# EAGLE design mainboard (EAGLE 6.1)

## Sheet 1 of 8
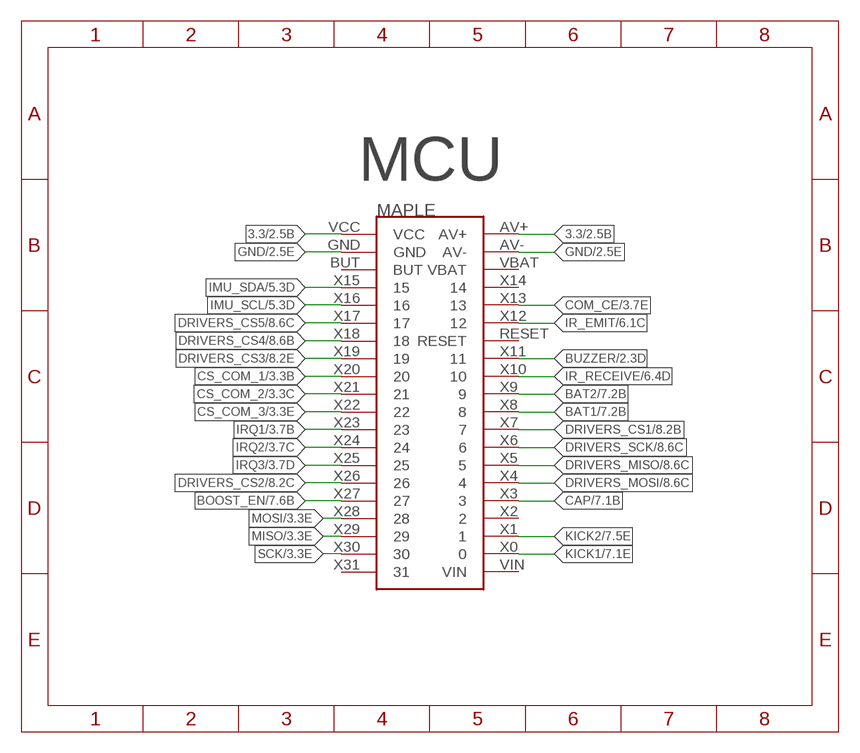
[diagram p0: schematic, sheet 1]

### Parts
MAPLE  MAPLE_MINI  [CONNEC_2X20]

### Nets
3.3: MAPLE.AV+ MAPLE.VCC ; also sheet 2,3,4,5,6,7,8
BAT1: MAPLE.X8 ; also sheet 7
BAT2: MAPLE.X9 ; also sheet 7
BOOST_EN: MAPLE.X27 ; also sheet 7
BUZZER: MAPLE.X11 ; also sheet 2
CAP: MAPLE.X3 ; also sheet 7
COM_CE: MAPLE.X13 ; also sheet 3
CS_COM_1: MAPLE.X20 ; also sheet 3
CS_COM_2: MAPLE.X21 ; also sheet 3
CS_COM_3: MAPLE.X22 ; also sheet 3
DRIVERS_CS1: MAPLE.X7 ; also sheet 8
DRIVERS_CS2: MAPLE.X26 ; also sheet 8
DRIVERS_CS3: MAPLE.X19 ; also sheet 8
DRIVERS_CS4: MAPLE.X18 ; also sheet 8
DRIVERS_CS5: MAPLE.X17 ; also sheet 8
DRIVERS_MISO: MAPLE.X5 ; also sheet 8
DRIVERS_MOSI: MAPLE.X4 ; also sheet 8
DRIVERS_SCK: MAPLE.X6 ; also sheet 8
GND [alim_big]: MAPLE.AV- MAPLE.GND ; also sheet 2,3,4,5,6,7,8
IMU_SCL: MAPLE.X16 ; also sheet 5
IMU_SDA: MAPLE.X15 ; also sheet 5
IR_EMIT: MAPLE.X12 ; also sheet 6
IR_RECEIVE: MAPLE.X10 ; also sheet 6
IRQ1: MAPLE.X23 ; also sheet 3
IRQ2: MAPLE.X24 ; also sheet 3
IRQ3: MAPLE.X25 ; also sheet 3
KICK1: MAPLE.X0 ; also sheet 7
KICK2: MAPLE.X1 ; also sheet 7
MISO: MAPLE.X29 ; also sheet 3
MOSI: MAPLE.X28 ; also sheet 3
SCK: MAPLE.X30 ; also sheet 3
Unconnected: MAPLE.BUT MAPLE.RESET MAPLE.VBAT MAPLE.VIN MAPLE.X2 MAPLE.X14 MAPLE.X31

### Notes on the sheet
- MCU

## Sheet 2 of 8
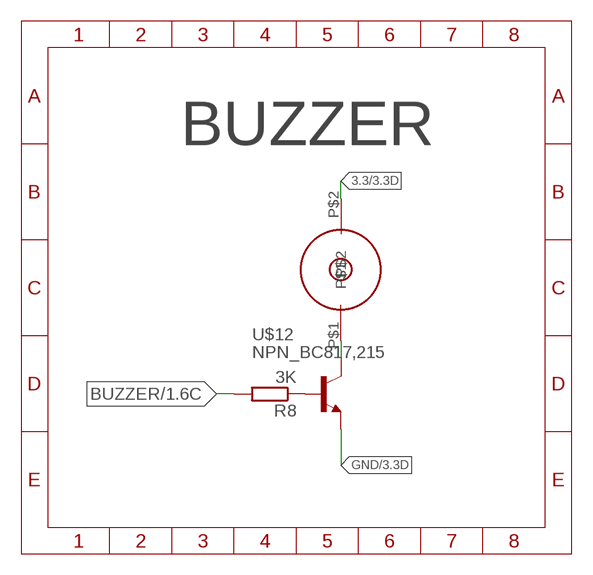
[diagram p1: schematic, sheet 2]

### Parts
R8  3K  R-EU_R0805  [R0805]
U$12  NPN_BC817,215  [SOT-23]
U$13  BUZZER66  [BUZZER66]

### Nets
3.3: U$13.P$2 ; also sheet 1,3,4,5,6,7,8
BUZZER: R8.2 ; also sheet 1
GND [alim_big]: U$12.2(E) ; also sheet 1,3,4,5,6,7,8
N$3: R8.1 U$12.1(B)
N$5: U$12.3(C) U$13.P$1

### Notes on the sheet
- BUZZER

## Sheet 3 of 8
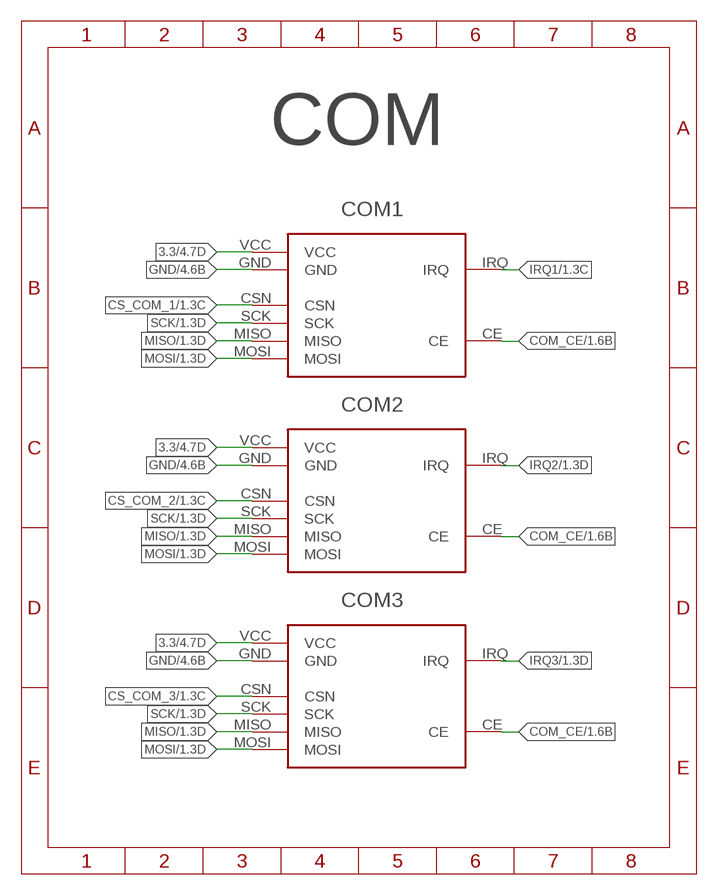
[diagram p2: schematic, sheet 3]

### Parts
COM1  NRF24L01  [NRF24L01]
COM2  NRF24L01  [NRF24L01]
COM3  NRF24L01  [NRF24L01]

### Nets
3.3: COM1.VCC COM2.VCC COM3.VCC ; also sheet 1,2,4,5,6,7,8
COM_CE: COM1.CE COM2.CE COM3.CE ; also sheet 1
CS_COM_1: COM1.CSN ; also sheet 1
CS_COM_2: COM2.CSN ; also sheet 1
CS_COM_3: COM3.CSN ; also sheet 1
GND [alim_big]: COM1.GND COM2.GND COM3.GND ; also sheet 1,2,4,5,6,7,8
IRQ1: COM1.IRQ ; also sheet 1
IRQ2: COM2.IRQ ; also sheet 1
IRQ3: COM3.IRQ ; also sheet 1
MISO: COM1.MISO COM2.MISO COM3.MISO ; also sheet 1
MOSI: COM1.MOSI COM2.MOSI COM3.MOSI ; also sheet 1
SCK: COM1.SCK COM2.SCK COM3.SCK ; also sheet 1

### Notes on the sheet
- COM

## Sheet 4 of 8
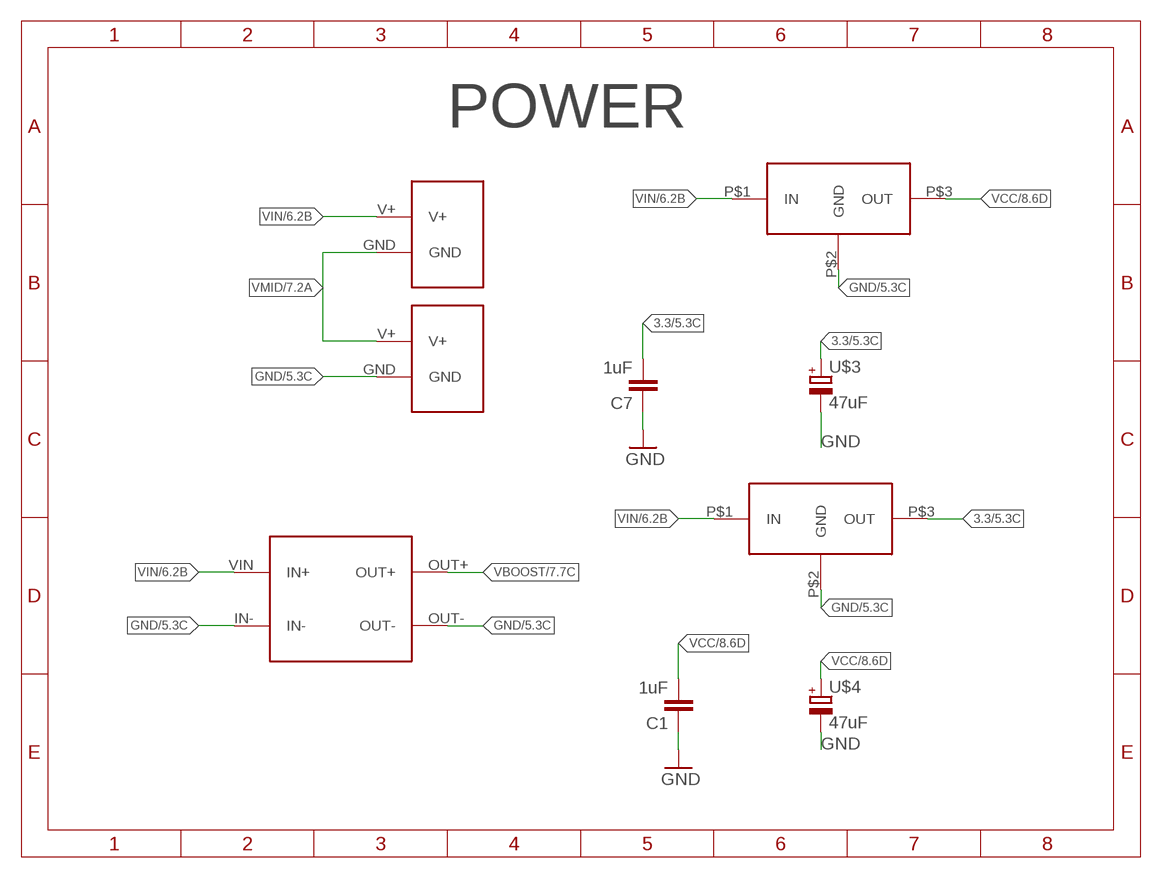
[diagram p3: schematic, sheet 4]

### Parts
C1  1uF  CAP0805  [0805@1]
C7  1uF  CAP0805  [0805@1]
REG3.3V  REG_5V  [TRACOPOWER]
REG5V  REG_5V  [TRACOPOWER]
U$3  47uF  CPOL_EUPANASONIC_D  [PANASONIC_D]
U$4  47uF  CPOL_EUPANASONIC_D  [PANASONIC_D]
U$5  BOOSTER  [BOOSTER_390V]
XT1  CONNEC_ALIM  [XT60]
XT60  CONNEC_ALIM  [XT60]

### Nets
3.3: C7.2 REG3.3V.P$3(OUT) U$3.+ ; also sheet 1,2,3,5,6,7,8
GND [alim_big]: C1.1 C7.1 REG3.3V.P$2(GND) REG5V.P$2(GND) U$3.- U$4.- U$5.IN- U$5.OUT- XT60.GND ; also sheet 1,2,3,5,6,7,8
VBOOST: U$5.OUT+ ; also sheet 7
VCC: C1.2 REG5V.P$3(OUT) U$4.+ ; also sheet 8
VIN [alim_big]: REG3.3V.P$1(IN) REG5V.P$1(IN) U$5.VIN(IN+) XT1.V+ ; also sheet 6,7,8
VMID [alim_big]: XT1.GND XT60.V+ ; also sheet 7,8

### Notes on the sheet
- POWER

## Sheet 5 of 8
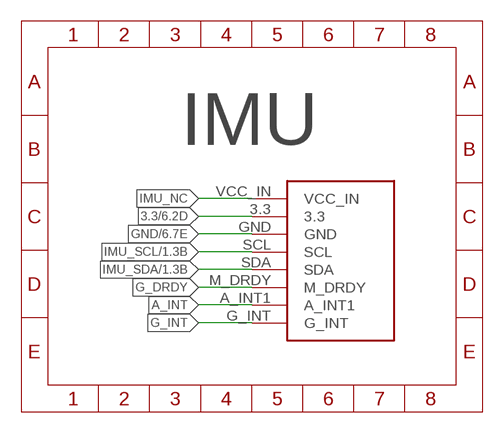
[diagram p4: schematic, sheet 5]

### Parts
U$2  GY-85  [GY-85]

### Nets
3.3: U$2.3.3 ; also sheet 1,2,3,4,6,7,8
A_INT: U$2.A_INT1
G_DRDY: U$2.M_DRDY
G_INT: U$2.G_INT
GND [alim_big]: U$2.GND ; also sheet 1,2,3,4,6,7,8
IMU_NC: U$2.VCC_IN
IMU_SCL: U$2.SCL ; also sheet 1
IMU_SDA: U$2.SDA ; also sheet 1

### Notes on the sheet
- IMU

## Sheet 6 of 8
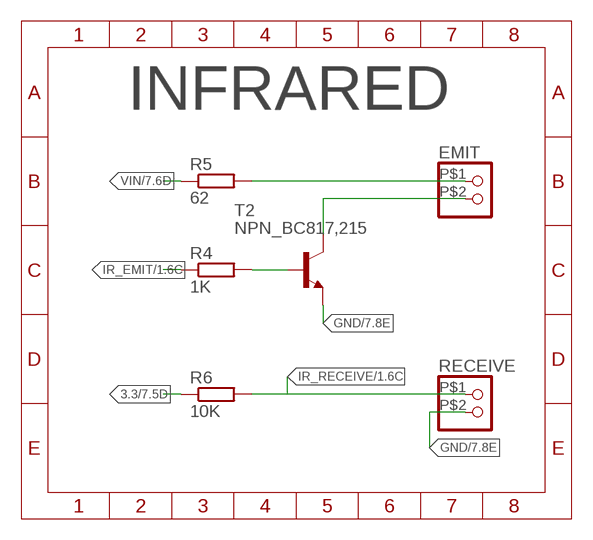
[diagram p5: schematic, sheet 6]

### Parts
EMIT  CONNEC_1X02JST-ZH  [JST_ZH_2P]
R4  1K  RESISTANCE-R0805  [R0805]
R5  62  RESISTANCE-R0805  [R0805]
R6  10K  RESISTANCE-R0805  [R0805]
RECEIVE  CONNEC_1X02JST-ZH  [JST_ZH_2P]
T2  NPN_BC817,215  [SOT-23]

### Nets
3.3: R6.1 ; also sheet 1,2,3,4,5,7,8
GND [alim_big]: RECEIVE.P$2 T2.2(E) ; also sheet 1,2,3,4,5,7,8
IR_EMIT: R4.1 ; also sheet 1
IR_RECEIVE: R6.2 RECEIVE.P$1 ; also sheet 1
N$6: EMIT.P$1 R5.2
N$7: EMIT.P$2 T2.3(C)
N$11: R4.2 T2.1(B)
VIN [alim_big]: R5.1 ; also sheet 4,7,8

### Notes on the sheet
- INFRARED

## Sheet 7 of 8
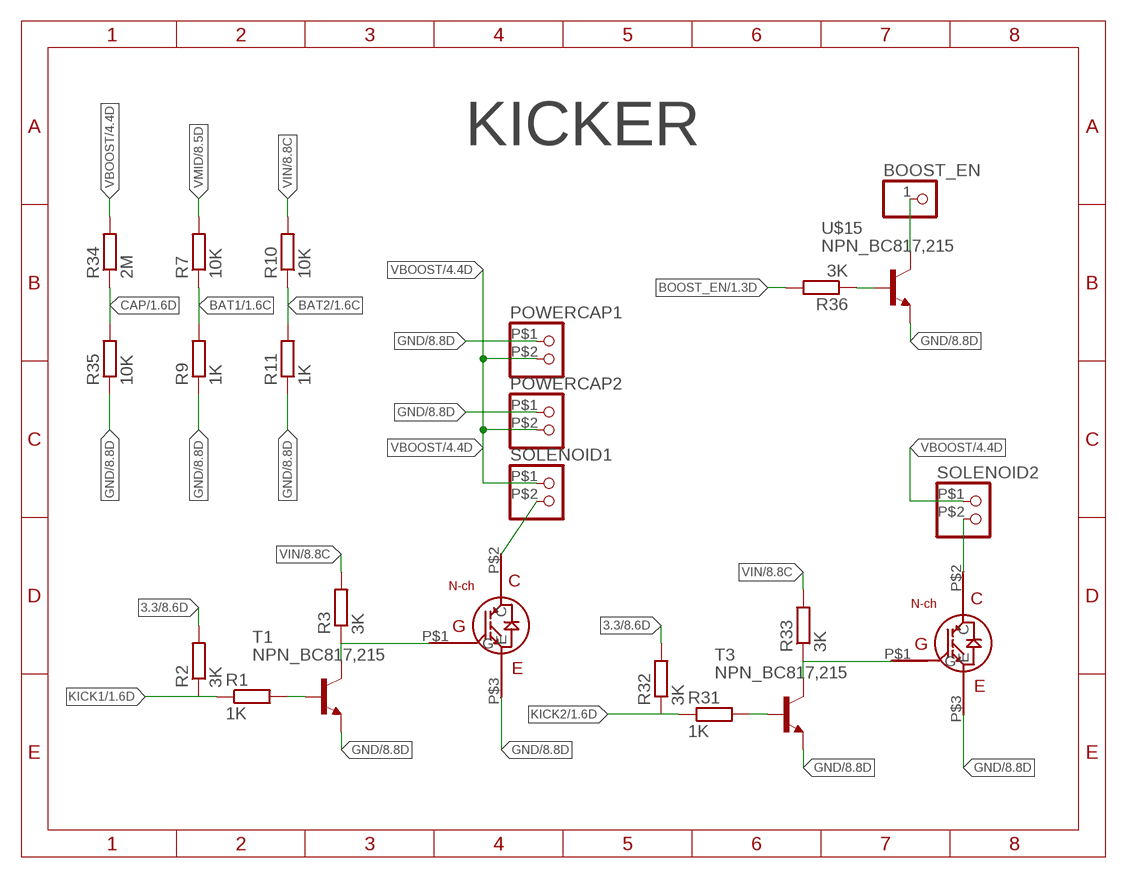
[diagram p6: schematic, sheet 7]

### Parts
BOOST_EN  CONNEC_1X01  [CONNEC_1X01]
POWERCAP1  CONNEC_1X02BIG  [CONNEC_1X02_BIG]
POWERCAP2  CONNEC_1X02BIG  [CONNEC_1X02_BIG]
R1  1K  RESISTANCE-R0805  [R0805]
R2  3K  RESISTANCE-R0805  [R0805]
R3  3K  RESISTANCE-R0805  [R0805]
R7  10K  RESISTANCE-R0805  [R0805]
R9  1K  RESISTANCE-R0805  [R0805]
R10  10K  RESISTANCE-R0805  [R0805]
R11  1K  RESISTANCE-R0805  [R0805]
R31  1K  RESISTANCE-R0805  [R0805]
R32  3K  RESISTANCE-R0805  [R0805]
R33  3K  RESISTANCE-R0805  [R0805]
R34  2M  RESISTANCE-R0805  [R0805]
R35  10K  RESISTANCE-R0805  [R0805]
R36  3K  RESISTANCE-R0805  [R0805]
SOLENOID1  CONNEC_1X02BIG  [CONNEC_1X02_BIG]
SOLENOID2  CONNEC_1X02BIG  [CONNEC_1X02_BIG]
T1  NPN_BC817,215  [SOT-23]
T3  NPN_BC817,215  [SOT-23]
U$1  TO-247A  [TO-247]
U$11  TO-247A  [TO-247]
U$15  NPN_BC817,215  [SOT-23]

### Nets
3.3: R2.2 R32.2 ; also sheet 1,2,3,4,5,6,8
BAT1: R7.1 R9.2 ; also sheet 1
BAT2: R10.1 R11.2 ; also sheet 1
BOOST_EN: R36.2 ; also sheet 1
CAP: R34.1 R35.2 ; also sheet 1
GND [alim_big]: POWERCAP1.P$1 POWERCAP2.P$1 R9.1 R11.1 R35.1 T1.2(E) T3.2(E) U$1.P$3(E) U$11.P$3(E) U$15.2(E) ; also sheet 1,2,3,4,5,6,8
KICK1: R1.1 R2.1 ; also sheet 1
KICK2: R31.1 R32.1 ; also sheet 1
N$1: R1.2 T1.1(B)
N$2 [alim_big]: SOLENOID1.P$2 U$1.P$2(C)
N$4: R3.1 T1.3(C) U$1.P$1(G)
N$17: R31.2 T3.1(B)
N$35: R33.1 T3.3(C) U$11.P$1(G)
N$36 [alim_big]: SOLENOID2.P$2 U$11.P$2(C)
N$37: BOOST_EN.1 U$15.3(C)
N$38: R36.1 U$15.1(B)
VBOOST: POWERCAP1.P$2 POWERCAP2.P$2 R34.2 SOLENOID1.P$1 SOLENOID2.P$1 ; also sheet 4
VIN [alim_big]: R3.2 R10.2 R33.2 ; also sheet 4,6,8
VMID [alim_big]: R7.2 ; also sheet 4,8

### Notes on the sheet
- KICKER

## Sheet 8 of 8
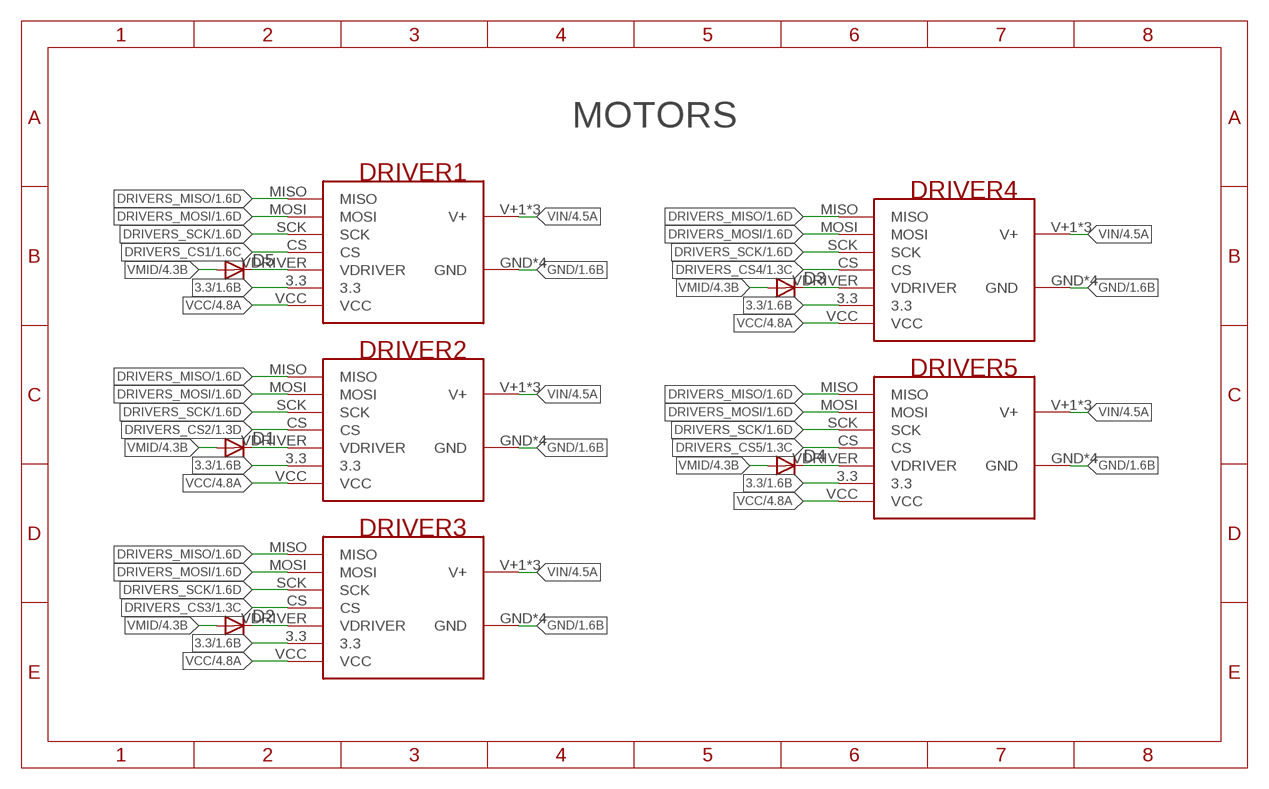
[diagram p7: schematic, sheet 8]

### Parts
D1  DIODESOD  [SOD-323]
D2  DIODESOD  [SOD-323]
D3  DIODESOD  [SOD-323]
D4  DIODESOD  [SOD-323]
D5  DIODESOD  [SOD-323]
DRIVER1  RHOBAN_BL_DRIVER  [RHOBAN_BL_DRIVER]
DRIVER2  RHOBAN_BL_DRIVER  [RHOBAN_BL_DRIVER]
DRIVER3  RHOBAN_BL_DRIVER  [RHOBAN_BL_DRIVER]
DRIVER4  RHOBAN_BL_DRIVER  [RHOBAN_BL_DRIVER]
DRIVER5  RHOBAN_BL_DRIVER  [RHOBAN_BL_DRIVER]

### Nets
3.3: DRIVER1.3.3 DRIVER2.3.3 DRIVER3.3.3 DRIVER4.3.3 DRIVER5.3.3 ; also sheet 1,2,3,4,5,6,7
DRIVERS_CS1: DRIVER1.CS ; also sheet 1
DRIVERS_CS2: DRIVER2.CS ; also sheet 1
DRIVERS_CS3: DRIVER3.CS ; also sheet 1
DRIVERS_CS4: DRIVER4.CS ; also sheet 1
DRIVERS_CS5: DRIVER5.CS ; also sheet 1
DRIVERS_MISO: DRIVER1.MISO DRIVER2.MISO DRIVER3.MISO DRIVER4.MISO DRIVER5.MISO ; also sheet 1
DRIVERS_MOSI: DRIVER1.MOSI DRIVER2.MOSI DRIVER3.MOSI DRIVER4.MOSI DRIVER5.MOSI ; also sheet 1
DRIVERS_SCK: DRIVER1.SCK DRIVER2.SCK DRIVER3.SCK DRIVER4.SCK DRIVER5.SCK ; also sheet 1
GND [alim_big]: DRIVER1.GND DRIVER1.GND2(GND) DRIVER1.GND3(GND) DRIVER1.GND4(GND) DRIVER2.GND DRIVER2.GND2(GND) DRIVER2.GND3(GND) DRIVER2.GND4(GND) DRIVER3.GND DRIVER3.GND2(GND) DRIVER3.GND3(GND) DRIVER3.GND4(GND) DRIVER4.GND DRIVER4.GND2(GND) DRIVER4.GND3(GND) DRIVER4.GND4(GND) DRIVER5.GND DRIVER5.GND2(GND) DRIVER5.GND3(GND) DRIVER5.GND4(GND) ; also sheet 1,2,3,4,5,6,7
N$8: D5.1(C) DRIVER1.VDRIVER
N$9: D3.1(C) DRIVER4.VDRIVER
N$10: D4.1(C) DRIVER5.VDRIVER
N$12: D2.1(C) DRIVER3.VDRIVER
N$13: D1.1(C) DRIVER2.VDRIVER
VCC: DRIVER1.VCC DRIVER2.VCC DRIVER3.VCC DRIVER4.VCC DRIVER5.VCC ; also sheet 4
VIN [alim_big]: DRIVER1.V+1(V+) DRIVER1.V+2(V+) DRIVER1.V+3(V+) DRIVER2.V+1(V+) DRIVER2.V+2(V+) DRIVER2.V+3(V+) DRIVER3.V+1(V+) DRIVER3.V+2(V+) DRIVER3.V+3(V+) DRIVER4.V+1(V+) DRIVER4.V+2(V+) DRIVER4.V+3(V+) DRIVER5.V+1(V+) DRIVER5.V+2(V+) DRIVER5.V+3(V+) ; also sheet 4,6,7
VMID [alim_big]: D1.2(A) D2.2(A) D3.2(A) D4.2(A) D5.2(A) ; also sheet 4,7

### Notes on the sheet
- MOTORS

## Library data of the parts
BOOST_EN = rhoban:CONNEC_1X01; FARNELL: -
C1 C7 = SparkFun-Passives:CAP: Capacitor Standard 0603 ceramic capacitor, and 0.1" leaded capacitor.; FARNELL: 2496946
COM1-COM3 = rhoban:NRF24L01; FARNELL: 1668343
D1-D5 = SparkFun-DiscreteSemi:DIODE: Diode These are standard reverse protection diodes and small signal diodes. SMA package can handle up to about 1A. SOD-323 can handle about 200mA. What the SOD-323 package when ordering, there are some mfgs out there that are 5-pin packages.; FARNELL: 8737843RL
DRIVER1-DRIVER5 = rhoban:RHOBAN_BL_DRIVER; FARNELL: 1593459,1593459,1593463
EMIT POWERCAP1 POWERCAP2 RECEIVE SOLENOID1 SOLENOID2 = rhoban:CONNEC_1X02; FARNELL: -
MAPLE = rhoban:MAPLE_MINI; FARNELL: 1593469,1593469
R1 R4 R9 R11 R31 = rhoban:RESISTANCE: RESISTOR, European symbol; FARNELL: 2446904
R2 R3 R32 R33 R36 = rhoban:RESISTANCE: RESISTOR, European symbol; FARNELL: 2446965
R5 = rhoban:RESISTANCE: RESISTOR, European symbol; FARNELL: 2138819
R6 R7 R10 R35 = rhoban:RESISTANCE: RESISTOR, European symbol; FARNELL: 2447553
R8 = rcl:R-EU_: RESISTOR, European symbol; FARNELL: 2446965
R34 = rhoban:RESISTANCE: RESISTOR, European symbol; FARNELL: 2129375
REG3.3V = rhoban:REG_5V; FARNELL: 1696319
REG5V = rhoban:REG_5V; FARNELL: 1696320
T1-T3 U$12 U$15 = rhoban:NPN; FARNELL: 1081223
U$1 U$11 = to-247_n-channel_igbt:TO-247; FARNELL: 1095012
U$2 = rhoban:GY-85; FARNELL: 1593463
U$3 U$4 = rhoban:CPOL_EU: 680 uF 16 V : http://fr.farnell.com/panasonic/eeufr1c681l/condensateur-radial-16v-680uf/dp/1800635 680 uF 25 V : http://fr.farnell.com/panasonic/eeufr1e681l/capacitor-radial-25v-680uf-20/dp/2063069 330 uF 25 V : http://fr.farnell.com/panasonic/eeufr1e331/condensateur-radial-25v-330uf/dp/1800648?Ntt=eeufr1e331; FARNELL: 9696946
U$5 = rhoban:BOOSTER; FARNELL: -
U$13 = rhoban:BUZZER; FARNELL: -
XT1 XT60 = rhoban:CONNEC_ALIM; FARNELL: -

## Net classes
0 default: width 0.254 mm
2 alim_big: width 2.032 mm
3 alim_very_big: width 0.762 mm

## Board
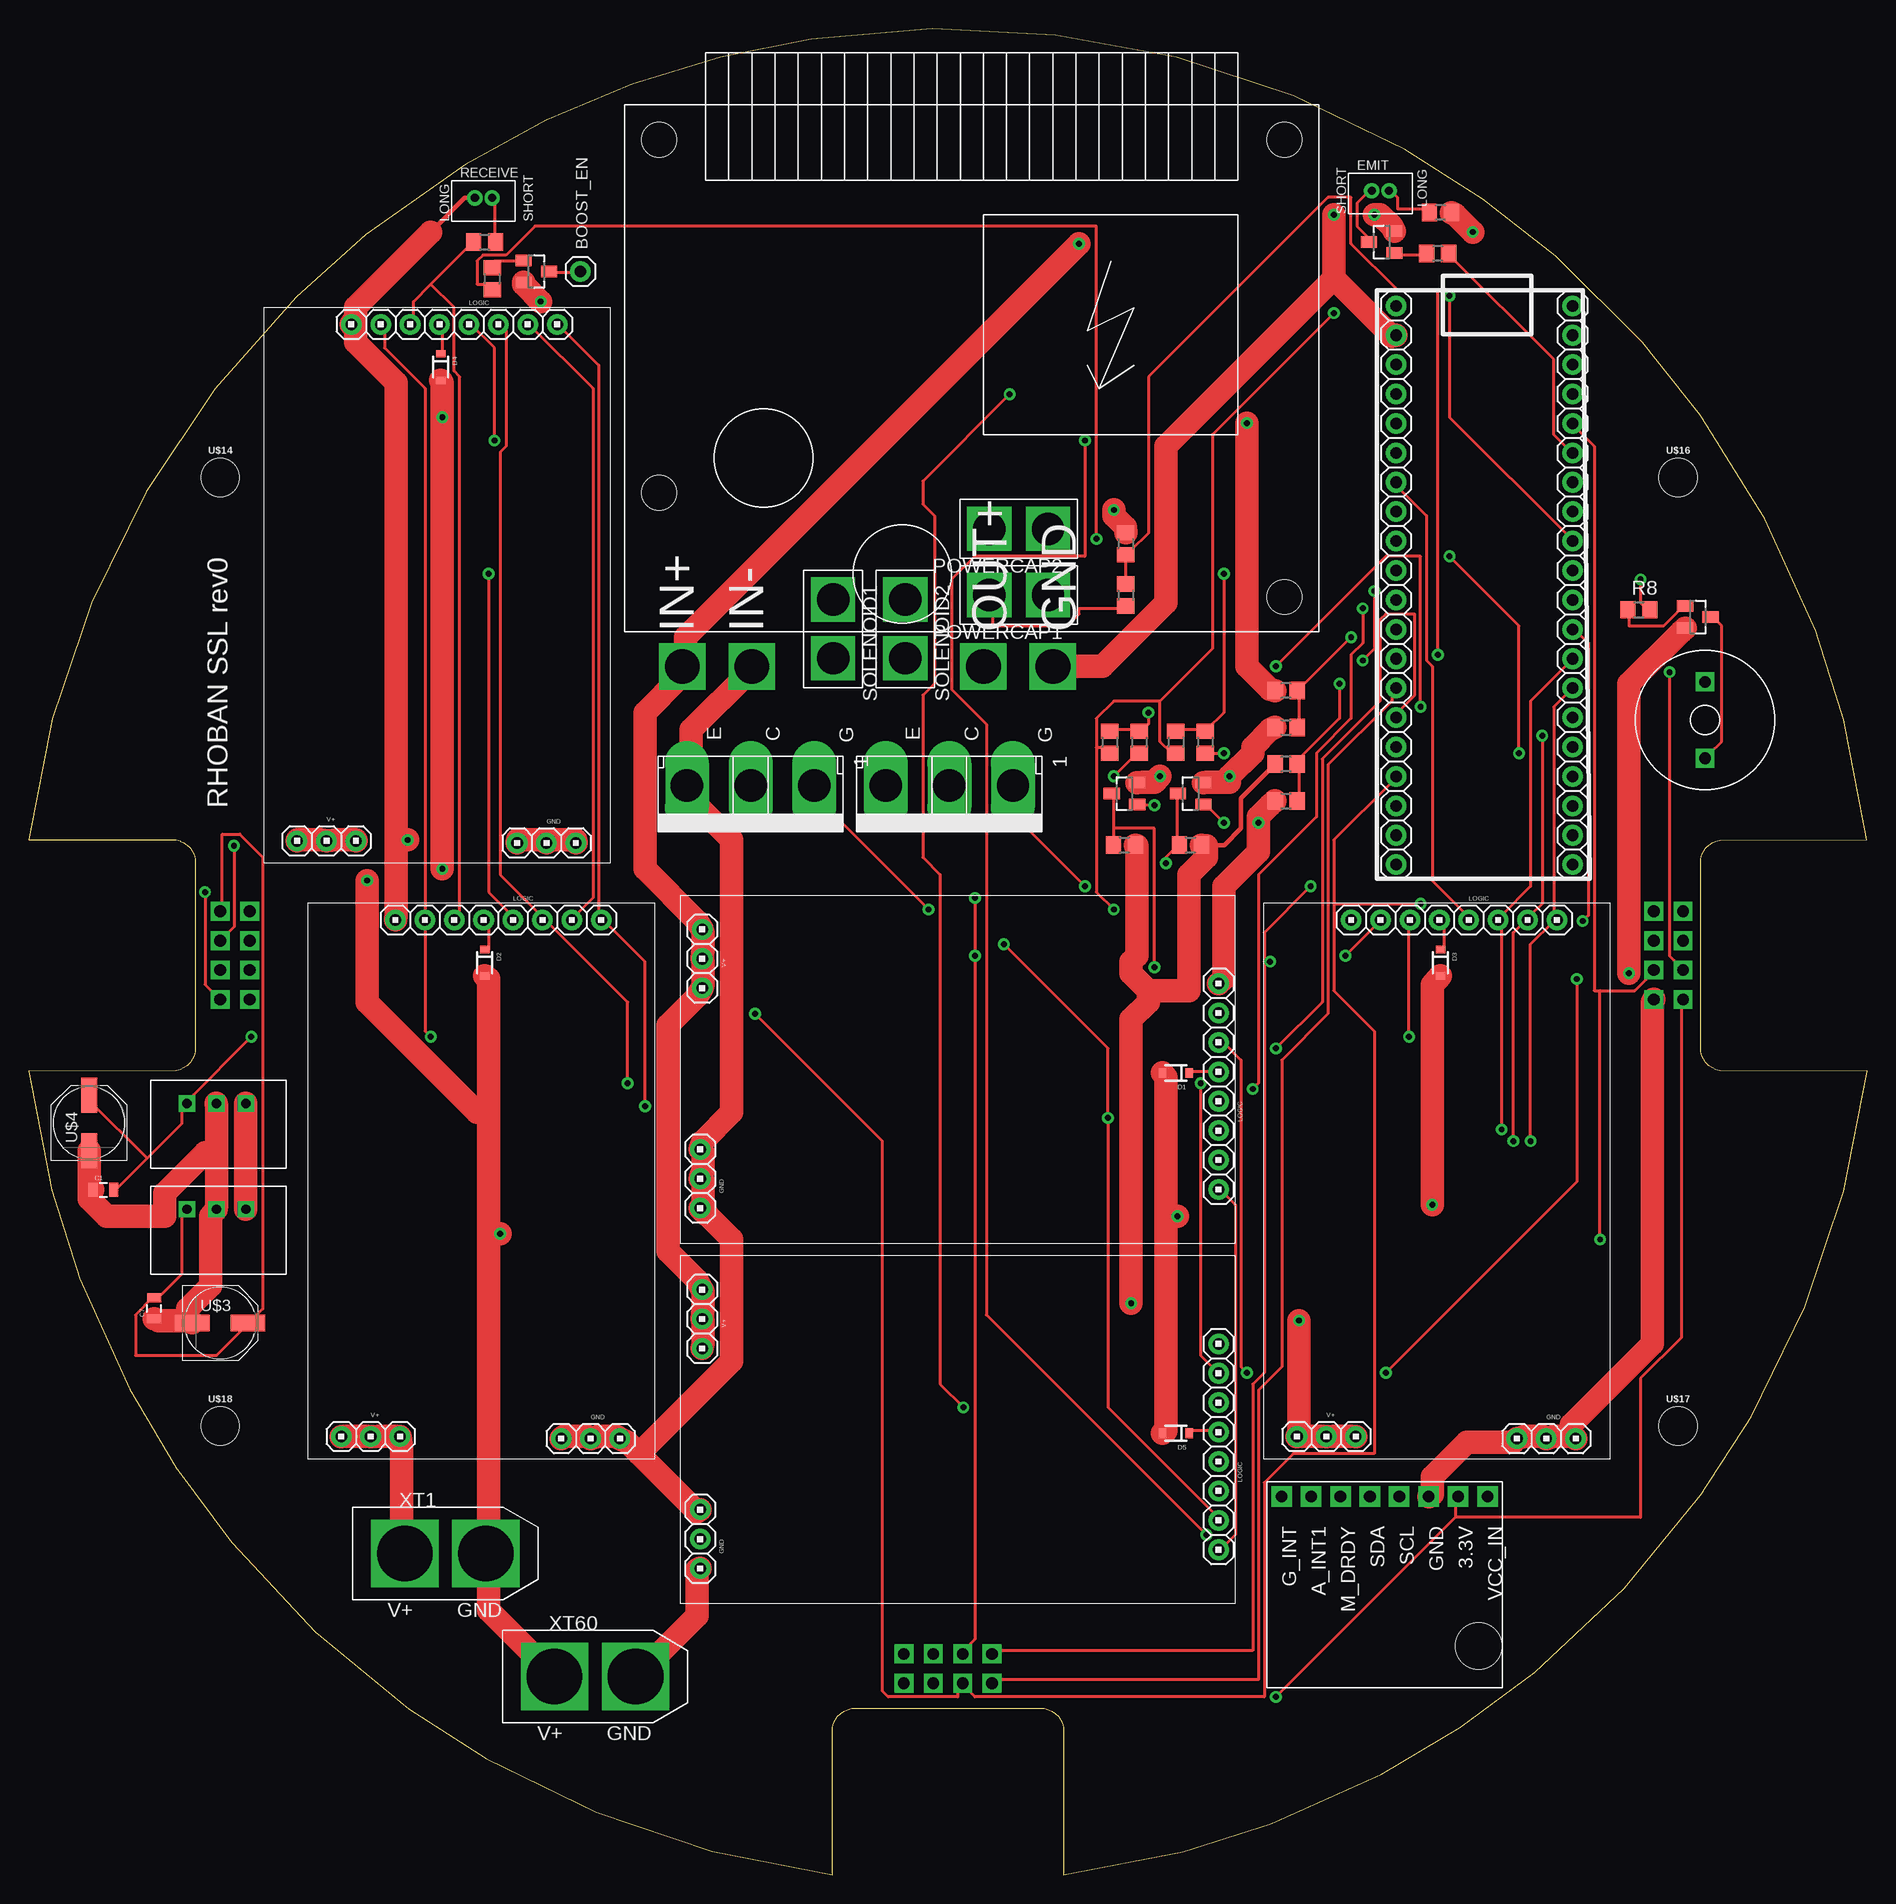
[diagram p8: board, top side]
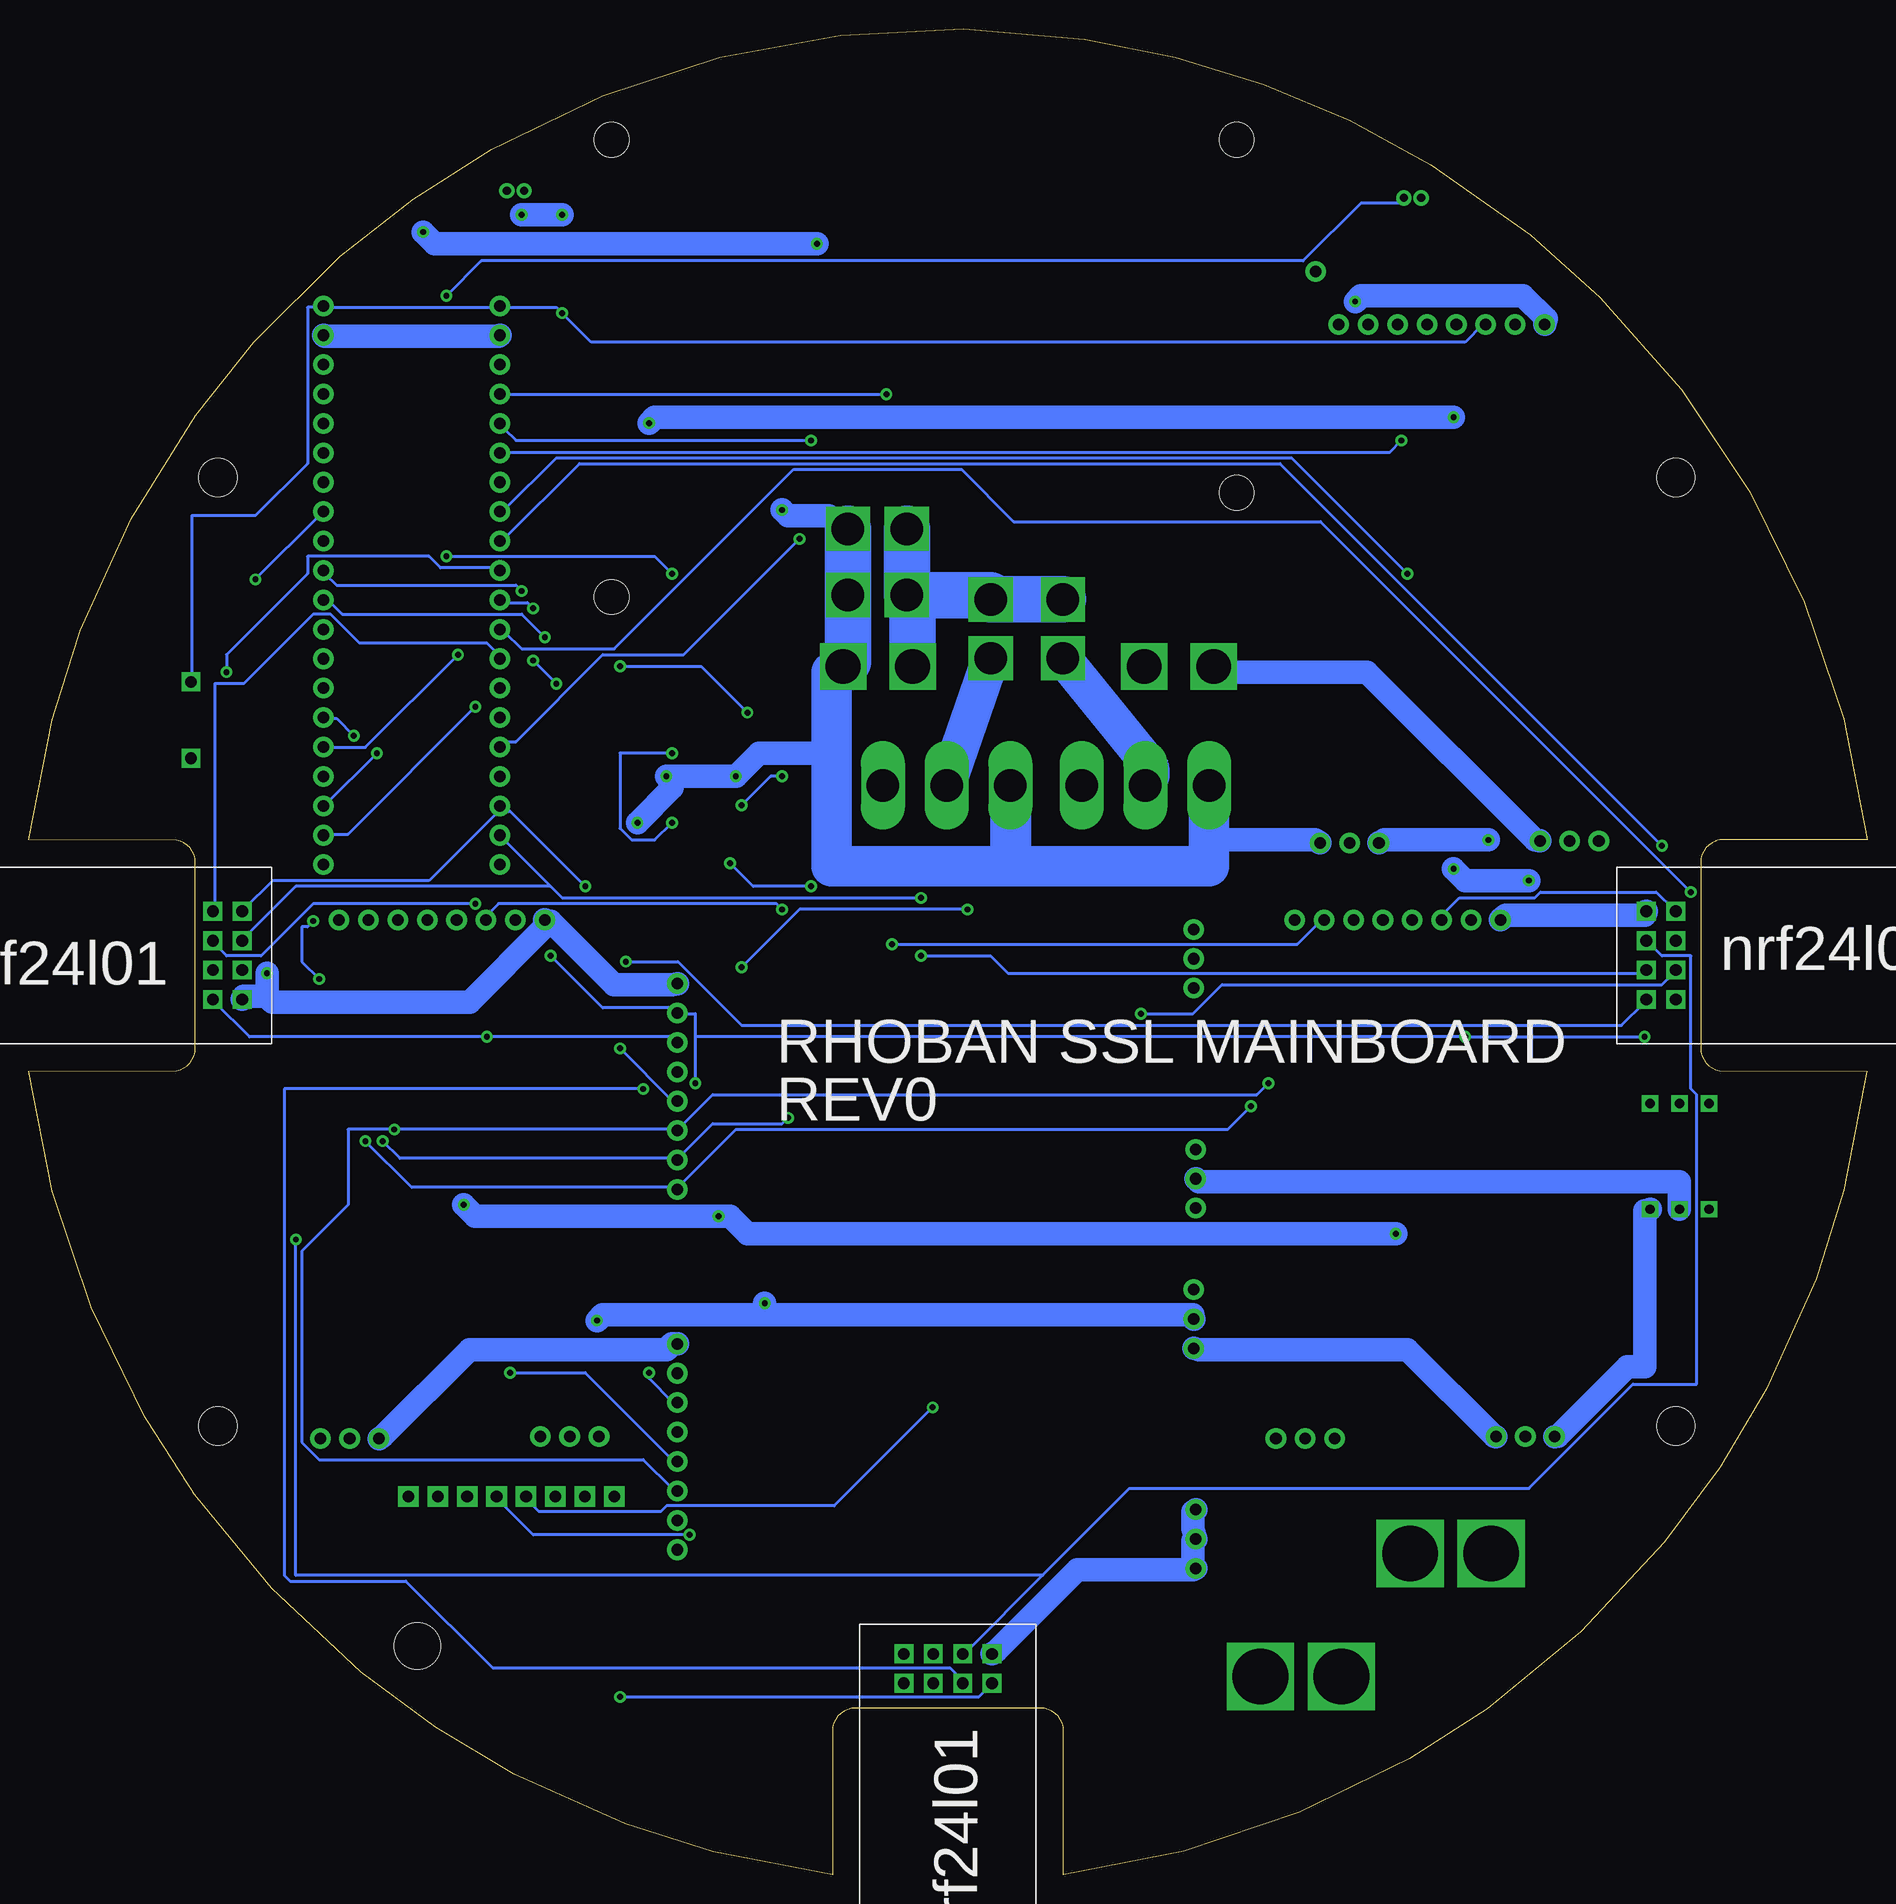
[diagram p9: board, bottom side, seen from below]

Size 158.77 x 159.38 mm. Coordinates in mm from the lower left corner, seen from the top.
Outline: 88.66,13.91 88.91,13.66 89.11,13.38 89.25,13.07 89.34,12.73 89.38,0 99.66,1.99 107.3,4.4 116.84,8.69 123.65,12.74 130.09,17.49 137.8,24.71 144.43,32.8 148.76,39.53 153.41,49.01 156.76,59.02 158.77,69.39 146.05,69.42 145.71,69.51 145.71,69.51 145.7,69.52 145.39,69.66 145.1,69.86 144.86,70.11 144.66,70.39 144.51,70.7 144.43,71.04 144.39,87.39 144.43,87.73 144.51,88.07 144.66,88.38 144.86,88.66 145.1,88.91 145.39,89.11 145.7,89.25 146.04,89.34 158.77,89.38 156.76,99.73 154.32,107.41 149.95,117.1 144.38,126.04 139.35,132.35 131.87,139.77 125.6,144.69 118.8,149.01 109.22,153.62 99.12,156.92 88.67,158.85 78.06,159.38 67.56,158.51 59.74,156.94 52.12,154.6 44.69,151.48 37.68,147.67 29.07,141.59 23.07,136.22 16.03,128.25 10.11,119.42 5.42,109.89 2.03,99.82 0,89.38 12.72,89.35 13.06,89.26 13.06,89.26 13.07,89.25 13.38,89.11 13.66,88.91 13.91,88.66 14.11,88.38 14.25,88.07 14.34,87.73 14.37,71.38 14.34,71.04 14.25,70.7 14.11,70.39 13.91,70.11 13.66,69.86 13.38,69.66 13.07,69.52 12.73,69.43 0,69.39 1.99,59.11 4.4,51.47 8.69,41.93 12.74,35.12 17.49,28.68 24.71,20.97 32.8,14.34 39.53,10.01 49.01,5.36 59.02,2.01 69.39,0 69.42,12.72 69.51,13.06 69.51,13.06 69.51,13.07 69.66,13.38 69.86,13.66 70.11,13.91 70.39,14.11 70.7,14.25 71.04,14.34 71.38,14.37 71.38,14.37 87.38,14.38 87.73,14.34 88.07,14.25 88.38,14.11 88.66,13.91
Copper layers (1*16): Top 0.035mm / dielectric 1.5mm / Bottom 0.035mm
Design rules: minimum track width 8mil, minimum drill 20mil, track to track 8mil, track to pad 8mil, pad to pad 8mil, via to via 8mil, smd to smd 8mil, copper to edge 10mil, drill to drill 8mil, minimum pad ring 12mil, minimum via ring 10mil, stop-mask expansion 4mil, vias tented up to drill 25mil, thermal gap 10mil
tRestrict: area 13.3,117.5 to 19.7,123.8; area 139.3,117.5 to 145.6,123.8; area 139.4,35.6 to 145.8,41.9; area 13.3,35.6 to 19.7,41.9
bRestrict: area 13.3,117.5 to 19.7,123.8; area 139.3,117.5 to 145.6,123.8; area 139.4,35.6 to 145.8,41.9; area 13.3,35.6 to 19.7,41.9

### Footprints (pad centres in the part's own frame; a part is rotated, then mirrored left to right if it is on the bottom)
CONNEC_1X01 = drill 1 pad 1.778: 1 0,0
0805@1 = smd 0.8 x 1.2: 1 -0.9,0; 2 0.9,0
NRF24L01 = drill 1.016 square: CE 2.54,0; CSN 2.54,2.54; GND 0,0; IRQ 7.62,2.54; MISO 7.62,0; MOSI 5.08,2.54; SCK 5.08,0; VCC 0,2.54
SOD-323 = smd 0.63 x 0.83: 1 -1.15,0; 2 1.15,0
RHOBAN_BL_DRIVER = drill 1 pad 1.778: 3.3 17.247,-0.513; CS 12.167,-0.513; GND 22.327,-0.513; GND2 8.01,44.27; GND3 5.47,44.27; GND4 2.93,44.27; MISO 4.547,-0.513; MOSI 7.087,-0.513; SCK 9.627,-0.513; V+1 27.01,44.093; V+2 24.47,44.093; V+3 21.93,44.093; VCC 19.787,-0.513; VDRIVER 14.707,-0.513
JST_ZH_2P = drill 0.7: P$1 1.27,0; P$2 -0.23,0
CONNEC_2X20 = drill 1 pad 1.778: AV+ 0,0; AV- 2.54,0; BUT 5.08,-15.24; GND 2.54,-15.24; RESET 15.24,0; VBAT 5.08,0; VCC 0,-15.24; VIN 48.26,0; X0 45.72,0; X1 43.18,0; X2 40.64,0; X3 38.1,0; X4 35.56,0; X5 33.02,0; X6 30.48,0; X7 27.94,0; X8 25.4,0; X9 22.86,0; X10 20.32,0; X11 17.78,0; X12 12.7,0; X13 10.16,0; X14 7.62,0; X15 7.62,-15.24; X16 10.16,-15.24; X17 12.7,-15.24; X18 15.24,-15.24; X19 17.78,-15.24; X20 20.32,-15.24; X21 22.86,-15.24; X22 25.4,-15.24; X23 27.94,-15.24; X24 30.48,-15.24; X25 33.02,-15.24; X26 35.56,-15.24; X27 38.1,-15.24; X28 40.64,-15.24; X29 43.18,-15.24; X30 45.72,-15.24; X31 48.26,-15.24
CONNEC_1X02_BIG = drill 2.8 square: P$1 0,0; P$2 5.08,0
R0805 = smd 1.3 x 1.5: 1 -0.95,0; 2 0.95,0
TRACOPOWER = drill 0.8 square: P$1 3.5,2; P$2 6.04,2; P$3 8.58,2
SOT-23 = smd 1 x 1.4: 1 -0.95,-1.1; 2 0.95,-1.1; 3 0,1.1
TO-247 = drill 2.8 pad 3.81 long: P$1 0,5.5; P$2 0,0; P$3 0,-5.5
GY-85 = drill 1.016 pad 1.778 square: 3.3 0,15.24; A_INT1 0,2.54; G_INT 0,0; GND 0,12.7; M_DRDY 0,5.08; SCL 0,10.16; SDA 0,7.62; VCC_IN 0,17.78 | hole 4: 12.9,17
PANASONIC_D = smd 3 x 1.4: + 2.4,0; - -2.4,0
BOOSTER_390V = drill 3 square: IN- 11,-3; OUT+ 31,-3; OUT- 37,-3; VIN 5,-3 | hole 3: 57,3; 57,42.5; 3,42.5; 3,12
BUZZER66 = drill 1 square: P$1 -3.3,0; P$2 3.3,0
STAND-OFF = hole 3.302: 0,0
XT60 = drill 4.8 square: GND 11.5,4; V+ 4.5,4

### Placement (x,y rotation side)
BOOST_EN  47.63,138.44 0 top
C1  6.42,59.12 0 top
C7  10.8,48.91 90 top
COM1  19.06,83.19 270 bottom
COM2  140.34,75.58 90 bottom
COM3  75.57,19.06 180 bottom
D1  99.07,69.22 180 top
D2  39.38,78.75 270 top
D3  121.93,78.75 270 top
D4  35.57,130.19 270 top
D5  99.07,38.11 180 top
DRIVER1  102.24,23.5 90 top
DRIVER2  102.24,54.62 90 top
DRIVER3  53.98,81.92 180 top
DRIVER4  136.53,81.92 180 top
DRIVER5  50.17,133.36 180 top
EMIT  116.22,145.43 0 top
MAPLE  133.33,135.47 270 top
POWERCAP1  88.02,110.5 180 top
POWERCAP2  88.02,116.22 180 top
R1  95.89,97.8 270 top
R2  93.35,97.8 270 top
R3  94.62,88.91 0 top
R4  121.68,139.98 180 top
R5  121.93,143.52 180 top
R6  39.38,140.98 0 top
R7  108.59,102.25 180 top
R8  139.07,109.23 0 top
R9  108.59,99.07 0 top
R10  108.59,95.89 180 top
R11  108.59,92.72 0 top
R31  101.61,97.8 270 top
R32  99.07,97.8 270 top
R33  100.34,88.91 0 top
R34  94.74,110.5 270 top
R35  94.74,114.94 270 top
R36  40.01,137.81 270 top
RECEIVE  38.74,144.79 0 top
REG3.3V  22.23,59.45 180 top
REG5V  22.23,68.59 180 top
SOLENOID1  69.46,110.12 270 top
SOLENOID2  75.69,110.12 270 top
T1  94.62,93.36 90 top
T2  116.85,140.98 90 top
T3  100.34,93.36 90 top
U$1  62.33,94.06 270 top
U$2  108.21,32.64 270 top
U$3  16.52,47.63 0 top
U$4  5.19,64.91 90 top
U$5  51.44,107.33 0 top
U$11  79.5,94.06 270 top
U$12  144.15,108.59 270 top
U$13  144.79,99.7 90 top
U$14  [STAND-OFF]  16.52,120.66 0 top
U$15  43.82,138.44 270 top
U$16  [STAND-OFF]  142.45,120.66 0 top
U$17  [STAND-OFF]  142.45,38.74 0 top
U$18  [STAND-OFF]  16.52,38.74 0 top
XT1  27.97,23.73 0 top
XT60  40.9,13.09 0 top

### Tracks (layer width: path | path; a pad name or v marks a point on that pad's centre or on a via)
3.3  (via drill 0.51)
  Top 0.254: 123.21,30.84 v107.71,15.34 | 123.21,30.84 123.21,32.34 U$2.3.3 | v105.21,43.34 104.71,43.84 104.71,70.34 103.21,71.84 DRIVER2.3.3 | v119.21,72.34 119.21,82.34 DRIVER4.3.3 | 123.21,30.84 139.21,30.84 139.21,42.84 142.71,46.34 142.71,75.34 COM2.VCC | 92.21,97.34 93.21,97.34 R2.2 | 92.21,97.34 92.21,99.84 93.71,101.34 97.71,101.34 | 97.71,101.34 97.71,97.84 98.71,96.84 R32.2 | 97.71,101.34 102.21,105.84 102.21,124.34 v112.71,134.84 | REG3.3V.P$3 13.21,57.34 13.21,51.84 11.21,49.84 C7.2 10.71,49.84 9.21,48.34 9.21,44.84 16.21,44.84 18.71,47.34 U$3.+ 19.21,47.84 20.21,48.84 20.21,87.84 18.21,89.84 16.71,89.84 16.71,83.34 COM1.VCC | 34.71,137.34 33.21,135.84 33.21,134.34 DRIVER5.3.3 | 34.71,137.34 38.21,140.84 R6.1 | 34.71,137.34 36.71,135.34 36.71,129.84 37.21,129.34 37.21,82.84 DRIVER3.3.3 | v93.71,83.34 92.21,84.84 92.21,97.34
  Bottom 0.254: v107.71,15.34 76.71,15.34 75.71,16.34 COM3.VCC | COM2.VCC 142.71,75.34 139.71,72.34 v119.21,72.34 103.21,72.34 DRIVER2.3.3 | v105.21,43.34 105.21,42.84 103.21,40.84 DRIVER1.3.3 | U$13.P$2 144.71,103.34 144.71,117.34 139.21,117.34 134.71,121.84 134.71,135.34 133.71,135.34 MAPLE.AV+ 133.21,135.34 118.21,135.34 MAPLE.VCC 117.71,135.34 113.21,135.34 v112.71,134.84 110.21,132.34 34.71,132.34 33.21,133.84 DRIVER5.3.3 | COM1.VCC 16.71,83.34 18.21,84.84 28.21,84.84 28.71,84.34 35.21,84.34 36.71,82.84 DRIVER3.3.3 | v93.71,83.34 94.21,83.84 118.21,83.84 119.21,82.84 DRIVER4.3.3
BAT1  (via drill 0.51)
  Top 0.254: R9.2 109.71,99.34 109.71,101.84 R7.1 109.71,102.34 v114.21,106.84
  Bottom 0.254: v114.21,106.84 116.21,108.84 131.71,108.84 132.71,109.84 133.21,109.84 MAPLE.X8
BAT2  (via drill 0.51)
  Top 0.254: R11.2 109.71,92.84 109.71,95.84 R10.1 109.71,96.34 113.21,99.84 v113.21,102.84 | v115.21,104.84 116.21,105.84 v116.21,110.84
  Bottom 0.254: v115.21,104.84 v113.21,102.84 | v116.21,110.84 116.71,111.34 132.21,111.34 133.21,112.34 MAPLE.X9
BOOST_EN  (via drill 0.51)
  Top 0.254: v92.21,115.34 92.21,142.34 43.71,142.34 41.21,139.84 39.21,139.84 38.71,139.34 38.71,137.34 39.71,137.34 R36.2
  Bottom 0.254: v92.21,115.34 102.21,105.34 109.21,105.34 116.71,97.84 117.71,97.84 MAPLE.X27
BUZZER  (via drill 0.51)
  Top 0.254: v139.21,111.84 139.21,109.84 139.71,109.34 R8.2
  Bottom 0.254: v139.21,111.84 133.71,117.34 MAPLE.X11
CAP  (via drill 0.51)
  Top 0.254: R34.1 94.71,111.84 94.71,113.84 R35.2 95.21,114.34 96.71,115.84 96.71,129.34 112.21,144.84 114.21,144.84 114.21,140.84 118.21,136.84 121.71,136.84 v121.71,105.34
  Bottom 0.254: v121.71,105.34 129.71,97.34 133.21,97.34 MAPLE.X3
COM_CE  (via drill 0.51)
  Top 0.254: 135.71,76.34 135.21,76.34 135.21,123.34 133.71,124.84 MAPLE.X13 | 135.71,76.34 138.71,76.34 140.21,77.84 COM2.CE | v135.71,54.84 135.71,76.34
  Bottom 0.254: 71.21,25.84 77.71,19.34 COM3.CE | 71.21,25.84 63.71,33.34 29.21,33.34 20.21,42.34 14.71,42.34 14.71,67.34 15.21,67.84 15.21,79.34 17.71,79.34 18.71,80.34 COM1.CE | v135.71,54.84 135.71,25.84 71.21,25.84
CS_COM_1  (via drill 0.51)
  Top 0.254: COM1.CSN 17.71,81.84 v17.71,88.84
  Bottom 0.254: v17.71,88.84 50.71,121.84 111.21,121.84 117.71,115.34 MAPLE.X20
CS_COM_2  (via drill 0.51)
  Top 0.254: v141.71,103.84 141.71,79.34 142.71,78.34 COM2.CSN
  Bottom 0.254: v141.71,103.84 141.71,105.34 134.71,112.34 134.71,113.84 124.21,113.84 123.21,112.84 118.21,112.84 MAPLE.X21
CS_COM_3  (via drill 0.51)
  Top 0.254: v105.71,67.84 106.21,68.34 106.21,86.34 111.21,91.34 111.21,96.84 114.21,99.84 114.21,105.34 115.21,106.34 v115.21,109.34
  Bottom 0.254: v105.71,67.84 136.71,67.84 136.71,25.84 136.21,25.34 126.21,25.34 118.71,17.84 79.21,17.84 78.21,16.84 COM3.CSN | v115.21,109.34 115.71,109.84 117.71,109.84 MAPLE.X22
DRIVERS_CS1  (via drill 0.51)
  Top 0.254: v117.21,43.34 133.71,59.84 v133.71,77.34 | v134.21,82.34 134.71,82.84 134.71,106.34 133.71,107.34 MAPLE.X7
  Bottom 0.254: v117.21,43.34 110.71,43.34 103.21,35.84 DRIVER1.CS | v133.71,77.34 135.21,78.84 135.21,81.84 134.71,81.84 v134.21,82.34
DRIVERS_CS2  (via drill 0.51)
  Top 0.254: v107.71,71.34 111.71,75.34 111.71,96.34 116.71,101.34 116.71,108.34 117.21,108.84 119.71,108.84 119.71,101.84 118.21,100.34 MAPLE.X26
  Bottom 0.254: v107.71,71.34 103.21,66.84 DRIVER2.CS
DRIVERS_CS3  (via drill 0.51)
  Top 0.254: v39.71,112.34 39.71,84.84 41.71,82.84 DRIVER3.CS
  Bottom 0.254: v39.71,112.34 49.71,122.34 113.21,122.34 117.71,117.84 MAPLE.X19
DRIVERS_CS4
  Top 0.254: DRIVER4.CS 124.21,82.84 121.21,85.84 121.21,104.34 120.71,104.84 120.71,117.34 118.21,119.84 MAPLE.X18
DRIVERS_CS5  (via drill 0.51)
  Top 0.254: v40.21,123.84 40.21,131.84 38.21,133.84 DRIVER5.CS
  Bottom 0.254: v40.21,123.84 41.21,122.84 117.71,122.84 MAPLE.X17
DRIVERS_MISO  (via drill 0.51)
  Top 0.254: DRIVER5.MISO 45.71,133.84 49.21,130.34 49.21,82.84 DRIVER3.MISO 49.71,82.34 53.21,78.84 v53.21,66.34 | MAPLE.X5 133.21,102.34 131.71,100.84 131.71,82.84 DRIVER4.MISO 131.71,82.34 129.71,80.34 v129.71,63.34 | DRIVER1.MISO 103.21,28.34 104.21,29.34 104.21,57.84 103.21,58.84 DRIVER2.MISO
  Bottom 0.254: v129.71,63.34 125.71,59.34 103.21,59.34 DRIVER2.MISO 102.71,59.34 97.71,64.34 55.21,64.34 v53.21,66.34
DRIVERS_MOSI  (via drill 0.51)
  Top 0.254: DRIVER3.MOSI 47.21,82.84 48.71,84.34 48.71,128.34 43.21,133.84 DRIVER5.MOSI | v130.71,98.34 130.71,83.84 129.71,82.84 DRIVER4.MOSI 129.21,82.34 128.21,81.34 v128.21,63.34 | DRIVER1.MOSI 102.71,30.84 93.21,40.34 v93.21,65.34 93.21,71.34 v84.21,80.34
  Bottom 0.254: v130.71,98.34 132.21,99.84 133.21,99.84 MAPLE.X4 | v93.21,65.34 93.71,64.84 99.71,64.84 102.71,61.84 DRIVER2.MOSI 103.21,61.84 126.71,61.84 v128.21,63.34 | v84.21,80.34 49.21,80.34 47.21,82.34 DRIVER3.MOSI
DRIVERS_SCK  (via drill 0.51)
  Top 0.254: DRIVER5.SCK 40.71,133.84 41.21,133.34 41.21,123.34 40.71,122.84 40.71,86.34 44.21,82.84 DRIVER3.SCK 44.71,82.34 51.71,75.34 v51.71,68.34 | MAPLE.X6 133.21,104.84 129.71,101.34 129.71,85.34 127.21,82.84 DRIVER4.SCK 127.21,82.34 v127.21,64.34
  Bottom 0.254: DRIVER1.SCK 103.21,33.34 105.71,35.84 133.71,35.84 135.21,37.34 135.21,53.84 131.21,57.84 131.21,64.34 v127.21,64.34 103.21,64.34 DRIVER2.SCK 102.71,64.34 99.71,67.34 52.71,67.34 v51.71,68.34
GND  (via drill 0.51)
  Top 0.406: RECEIVE.P$2 37.65,144.79 34.71,141.84 34.46,141.59
  Top 2.032: 5.21,59.34 5.21,62.34 U$4.- | 5.21,59.34 C1.1 | 13.71,47.84 11.21,47.84 C7.1 | 13.71,47.84 U$3.- | 16.21,62.34 16.21,66.34 REG5V.P$2 | 16.21,62.34 16.21,57.84 REG3.3V.P$2 15.71,56.84 15.71,50.84 13.71,48.84 13.71,47.84 | 5.21,59.34 5.21,58.34 6.71,56.84 11.71,56.84 11.71,58.84 15.21,62.34 16.21,62.34 | DRIVER3.GND2 46.21,37.84 48.21,37.84 DRIVER3.GND3 49.21,37.84 50.71,37.84 DRIVER3.GND4 51.71,37.34 52.71,36.34 | 52.71,36.34 57.71,31.34 DRIVER1.GND2 | 52.71,36.34 60.71,44.34 60.71,54.84 58.71,56.84 DRIVER2.GND4 58.21,57.84 58.21,59.84 DRIVER2.GND3 58.21,60.84 58.21,62.34 DRIVER2.GND2 58.21,63.34 60.71,65.84 60.71,89.34 57.21,92.84 57.21,93.34 U$1.P$3 57.21,94.34 57.21,98.84 62.21,103.84 U$5.IN- | XT60.GND 52.71,17.34 57.71,22.34 57.71,26.34 DRIVER1.GND4 | U$2.GND 121.21,32.84 121.21,34.34 124.21,37.34 128.21,37.34 DRIVER4.GND2 129.21,37.84 130.71,37.84 DRIVER4.GND3 131.71,37.84 133.21,37.84 | 133.21,37.84 DRIVER4.GND4 | R11.1 107.21,92.34 106.21,91.34 v106.21,90.84 106.21,88.34 103.21,85.34 103.21,77.34 DRIVER2.GND | v138.21,77.84 138.21,102.84 142.71,107.34 U$12.2 | 133.21,37.84 133.21,38.84 140.21,45.84 140.21,75.34 COM2.GND | v44.21,135.84 42.71,137.34 U$15.2 | 34.71,141.84 28.21,135.34 28.21,134.34 DRIVER5.GND 28.21,133.34 28.21,132.34 31.71,128.84 31.71,89.34 | 31.71,89.34 31.71,82.84 DRIVER3.GND | v116.21,143.34 116.71,143.34 117.71,142.34 T2.2 | 112.71,137.84 v112.71,143.34 | 112.71,137.84 117.71,132.84 MAPLE.GND | DRIVER5.GND2 42.21,89.34 44.21,89.34 DRIVER5.GND3 45.21,89.34 47.21,89.34 DRIVER5.GND4 | T3.2 101.71,94.34 103.71,94.34 v103.71,94.84 105.71,96.84 105.71,97.34 107.21,98.84 R9.1
  Top 2.032: v93.71,117.84 93.71,117.34 94.71,116.34 R35.1 | v97.71,94.84 97.21,94.34 96.21,94.34 T1.2 | 112.71,137.84 98.21,123.34 98.21,109.84 92.71,104.34 88.71,104.34 U$5.OUT- | v32.71,89.34 31.71,89.34
  Bottom 2.032: 58.21,26.34 68.21,26.34 75.21,19.34 COM3.GND | 58.21,26.34 DRIVER1.GND4 | 58.21,26.34 58.21,28.84 DRIVER1.GND3 58.21,29.84 58.21,31.34 DRIVER1.GND2 | REG3.3V.P$2 16.21,57.84 16.21,59.84 57.71,59.84 DRIVER2.GND3 | DRIVER1.GND 103.21,45.84 103.71,45.34 120.71,45.34 128.21,37.84 DRIVER4.GND2 | DRIVER2.GND 103.21,76.84 108.21,76.84 113.71,82.34 DRIVER4.GND 114.21,81.84 120.71,75.34 137.71,75.34 138.21,75.84 | 138.21,75.84 v138.21,77.84 | 138.21,75.84 140.21,75.84 COM2.GND | COM1.GND 19.21,82.84 31.21,82.84 DRIVER3.GND | v44.21,135.84 43.71,136.34 29.71,136.34 27.71,134.34 DRIVER5.GND | v112.71,143.34 v116.21,143.34 | MAPLE.AV- 133.21,132.84 118.21,132.84 MAPLE.GND | v93.71,117.84 93.21,117.34 89.71,117.34 POWERCAP2.P$1 | 89.46,96.84 95.71,96.84 v97.71,94.84 103.21,94.84 | U$5.OUT- 88.71,104.34 89.46,103.84 | 103.21,94.84 v103.71,94.84 | 56.83,89.34 47.71,89.34 DRIVER5.GND4 | v32.71,89.34 41.71,89.34 DRIVER5.GND2 | v106.21,90.84 103.21,93.84 103.21,94.84
  Bottom 3.5: U$1.P$3 56.83,89.34 56.83,87.09 73.96,87.09 73.96,94.06 U$11.P$3 74,87.09 89.46,87.09 89.46,96.84 89.46,103.84 88.46,103.84
  Bottom 4: POWERCAP1.P$1 POWERCAP2.P$1 88.02,104.75 U$5.OUT-
IMU_SCL  (via drill 0.51)
  Top 0.254: v101.71,29.34 82.71,48.34 82.71,99.34 79.71,102.34 79.71,111.84 81.71,113.84 91.21,113.84 v91.21,123.84
  Bottom 0.254: v101.71,29.34 115.21,29.34 118.21,32.34 U$2.SCL | v91.21,123.84 116.71,123.84 117.71,124.84 MAPLE.X16
IMU_SDA  (via drill 0.51)
  Top 0.254: v80.71,40.34 78.71,42.34 78.71,86.34 77.21,87.84 77.21,101.84 78.21,102.84 78.21,117.34 77.21,118.34 77.21,120.34 v84.71,127.84
  Bottom 0.254: v80.71,40.34 89.21,31.84 103.71,31.84 104.21,31.34 114.71,31.34 115.71,32.34 U$2.SDA | v84.71,127.84 117.71,127.84 MAPLE.X15
IR_EMIT
  Top 0.254: R4.1 122.71,139.84 131.71,130.84 131.71,124.34 133.21,122.84 MAPLE.X12
IR_RECEIVE  (via drill 0.51)
  Top 0.254: R6.2 40.21,141.34 40.21,144.34 RECEIVE.P$1 | v122.71,136.34 122.71,125.84 133.21,115.34 MAPLE.X10
  Bottom 0.254: v122.71,136.34 119.71,139.34 48.71,139.34 43.71,144.34 40.21,144.34 RECEIVE.P$1
IRQ1  (via drill 0.51)
  Top 0.254: v15.21,84.84 15.21,76.84 16.21,75.84 COM1.IRQ
  Bottom 0.254: v15.21,84.84 47.21,116.84 73.71,116.84 78.21,121.34 92.71,121.34 108.21,105.84 116.21,105.84 117.71,107.34 MAPLE.X23
IRQ2
  Bottom 0.254: COM2.IRQ 142.71,83.34 142.71,102.84 140.21,102.84 134.21,108.84 132.71,108.84 130.21,106.34 119.21,106.34 118.21,105.34 MAPLE.X24
IRQ3
  Top 0.254: COM3.IRQ 83.21,16.84 106.21,16.84 106.21,41.84 108.21,43.84 108.21,70.34 112.21,74.34 112.21,95.84 117.71,101.34 117.71,102.34 MAPLE.X25
KICK1  (via drill 0.51)
  Top 0.254: R2.1 93.71,98.84 95.71,98.84 R1.1 96.21,98.84 96.71,99.34 v96.71,100.34 | v107.71,104.34 117.21,113.84 120.21,113.84 v120.21,100.84
  Bottom 0.254: v96.71,100.34 100.71,104.34 v107.71,104.34 | v120.21,100.84 131.21,89.84 133.21,89.84 MAPLE.X0
KICK2  (via drill 0.51)
  Top 0.254: R32.1 99.21,98.84 101.21,98.84 R31.1 101.71,98.84 103.21,100.34 v103.21,112.34 | v122.71,113.84 128.71,107.84 v128.71,96.84
  Bottom 0.254: v103.21,112.34 104.71,113.84 v122.71,113.84 | v128.71,96.84 133.21,92.34 MAPLE.X1
MISO  (via drill 0.51)
  Top 0.254: 106.71,78.84 106.71,81.34 v110.71,85.34 | 106.71,78.84 106.71,43.34 105.71,42.34 105.71,19.34 83.21,19.34 COM3.MISO | 106.71,78.84 v107.21,78.84
  Bottom 0.254: v110.71,85.34 117.21,91.84 117.71,91.84 MAPLE.X29 118.21,91.84 124.21,85.84 137.71,85.84 140.21,83.34 COM2.MISO | v107.21,78.84 102.71,78.84 97.21,73.34 21.21,73.34 19.21,75.34 COM1.MISO
MOSI  (via drill 0.51)
  Top 0.254: 112.71,83.84 112.71,89.34 117.71,94.34 MAPLE.X28 | 112.71,83.84 112.71,76.34 116.21,72.84 116.21,36.34 109.21,36.34 106.71,33.84 106.71,15.34 81.71,15.34 80.71,16.34 COM3.MOSI 80.21,16.34 80.21,15.34 74.21,15.34 73.71,15.84 73.71,63.34 v62.71,74.34 | 112.71,83.84 v120.21,83.84
  Bottom 0.254: v62.71,74.34 58.21,74.34 55.71,76.84 17.71,76.84 16.71,77.84 COM1.MOSI | v120.21,83.84 134.21,83.84 138.71,79.34 141.71,79.34 142.71,80.34 COM2.MOSI
N$1  (via drill 0.51)
  Top 0.254: v97.21,92.34 96.21,92.34 T1.1 | v93.71,94.84 95.71,96.84 R1.2
  Bottom 0.254: v97.21,92.34 94.71,94.84 v93.71,94.84
N$2
  Bottom 3.2: SOLENOID1.P$2 62.21,96.09
  Bottom 3.3: 62.21,96.09 arc85 U$1.P$2
N$3
  Top 0.254: U$12.1 142.71,109.34 141.21,107.84 138.21,107.84 138.21,108.84 R8.1
N$4  (via drill 0.51)
  Top 0.254: 93.71,90.34 93.71,89.34 R3.1 | 93.71,90.34 93.71,93.34 T1.3 | 93.71,90.34 97.21,90.34 v97.21,78.34 | v77.71,83.34 68.21,92.84 68.21,93.84 U$1.P$1
  Bottom 0.254: v97.21,78.34 92.21,83.34 v77.71,83.34
N$5
  Top 0.254: U$12.3 145.71,108.34 146.21,107.84 146.21,97.84 145.21,96.84 U$13.P$1
N$6
  Top 0.254: R5.2 120.71,143.84 118.21,143.84 118.21,144.84 117.71,145.34 EMIT.P$1
N$7
  Top 0.254: T2.3 115.71,141.34 114.71,142.34 114.71,144.34 115.71,145.34 EMIT.P$2
N$8
  Top 0.254: D5.1 100.21,38.34 102.71,38.34 DRIVER1.VDRIVER
N$9
  Top 0.254: D3.1 122.21,79.84 122.21,82.34 DRIVER4.VDRIVER
N$10
  Top 0.254: D4.1 35.71,131.34 35.71,133.84 DRIVER5.VDRIVER
N$11
  Top 0.254: T2.1 118.21,139.84 120.71,139.84 R4.2
N$12
  Top 0.254: D2.1 39.71,79.84 39.71,82.34 DRIVER3.VDRIVER
N$13
  Top 0.254: D1.1 100.21,69.34 102.71,69.34 DRIVER2.VDRIVER
N$17  (via drill 0.51)
  Top 0.254: v103.21,90.84 101.71,92.34 T3.1 | v103.21,96.84 101.71,96.84 R31.2
  Bottom 0.254: v103.21,90.84 104.71,89.34 106.71,89.34 107.71,90.34 107.71,96.84 v103.21,96.84
N$35  (via drill 0.51)
  Top 0.254: T3.3 99.21,93.34 99.21,89.34 R33.1 99.21,88.84 98.21,87.84 v98.21,87.34 | v91.21,85.34 85.21,91.34 85.21,93.84 U$11.P$1
  Bottom 0.254: v98.21,87.34 96.21,85.34 v91.21,85.34
N$36
  Bottom 3.3: SOLENOID2.P$2 U$11.P$2
N$37
  Top 0.254: U$15.3 45.21,138.34 47.21,138.34 BOOST_EN.1
N$38
  Top 0.254: U$15.1 42.71,139.34 40.21,139.34 40.21,138.84 R36.1
SCK  (via drill 0.51)
  Top 0.254: v81.71,84.34 v81.71,79.34 81.71,20.34 80.71,19.34 COM3.SCK
  Bottom 0.254: v81.71,84.34 112.71,84.34 113.71,85.34 | 113.71,85.34 117.71,89.34 MAPLE.X30 | v81.71,79.34 75.71,79.34 74.21,77.84 19.21,77.84 COM1.SCK | 113.71,85.34 135.71,85.34 140.21,80.84 COM2.SCK
VBOOST
  Top 0.254: R34.2 94.71,109.34 90.71,109.34 90.71,108.84 89.71,107.84 83.21,107.84 83.21,110.34 POWERCAP1.P$2
  Bottom 4: POWERCAP1.P$2 75.69,110.5 SOLENOID2.P$1 SOLENOID1.P$1 | POWERCAP1.P$2 POWERCAP2.P$2 | U$5.OUT+ 82.44,110 POWERCAP1.P$2
VCC  (via drill 0.51)
  Top 0.254: v101.21,68.34 101.21,44.84 102.71,43.34 DRIVER1.VCC | v113.71,79.34 116.71,82.34 DRIVER4.VCC | 10.21,61.84 13.21,64.84 13.21,66.34 REG5V.P$3 13.71,66.84 v19.21,72.34 | 10.21,61.84 7.71,59.34 C1.2 | 10.21,61.84 5.21,66.84 U$4.+ | DRIVER5.VCC 30.71,133.84 30.71,131.84 34.21,128.34 34.21,82.84 DRIVER3.VCC 34.21,82.34 34.21,72.84 v34.71,72.34
  Bottom 0.254: 101.21,72.34 101.21,74.34 102.71,74.34 DRIVER2.VCC 103.21,74.84 109.21,74.84 v113.71,79.34 | 101.21,72.34 v101.21,68.34 | v19.21,72.34 v34.71,72.34 101.21,72.34
VIN  (via drill 0.51)
  Top 0.406: R33.2 103.27,88.91 104.71,90.34 104.71,92.96 R10.2
  Top 2.032: DRIVER5.V+1 23.21,89.34 25.21,89.34 DRIVER5.V+2 26.71,89.34 28.21,89.34 DRIVER5.V+3 | v124.71,141.84 123.21,143.34 R5.1 | v90.71,140.84 56.71,106.84 56.71,104.34 U$5.VIN 56.21,103.34 53.21,100.34 53.21,86.84 57.71,82.34 DRIVER2.V+1 58.21,81.34 58.21,79.84 DRIVER2.V+2 58.21,78.84 58.21,76.84 DRIVER2.V+3 57.71,75.84 55.21,73.34 55.21,53.84 57.71,51.34 DRIVER1.V+1 58.21,50.34 58.21,48.84 DRIVER1.V+2 58.21,47.84 58.21,45.84 DRIVER1.V+3 | REG3.3V.P$1 18.71,57.84 18.71,66.34 REG5V.P$1 | DRIVER3.V+1 27.21,37.84 29.21,37.84 DRIVER3.V+2 30.21,37.84 31.71,37.84 DRIVER3.V+3 32.21,36.84 32.21,27.84 XT1.V+ | 96.71,76.34 95.21,77.84 95.21,78.84 95.71,79.34 95.71,88.84 R3.2 | 96.71,76.34 100.21,76.34 100.21,86.34 101.71,87.84 101.71,88.84 R33.2 | 109.71,37.84 111.71,37.84 DRIVER4.V+2 112.71,37.84 114.21,37.84 DRIVER4.V+3 | 109.71,37.84 DRIVER4.V+1 | v109.71,47.84 109.71,37.84 | v95.21,49.34 95.21,73.84 96.71,75.34 96.71,76.34
  Bottom 2.032: v124.71,141.84 123.71,140.84 v90.71,140.84 | DRIVER5.V+3 28.71,89.34 43.21,103.84 56.21,103.84 U$5.VIN | REG3.3V.P$1 19.21,57.34 19.21,43.84 20.71,43.84 26.71,37.84 DRIVER3.V+1 | v109.71,47.84 109.21,48.34 95.21,48.34 | 95.21,48.34 58.21,48.34 DRIVER1.V+2 | v95.21,49.34 95.21,48.34 | DRIVER3.V+3 32.21,37.84 39.71,45.34 57.71,45.34 DRIVER1.V+3
VMID  (via drill 0.51)
  Top 2.032: 98.21,56.84 98.21,68.84 D1.2 | 98.21,56.84 98.21,38.34 D5.2 | v121.21,57.84 121.21,76.84 121.71,77.34 D3.2 | v99.21,56.84 98.21,56.84 | 39.71,55.34 39.71,27.84 XT1.GND 39.71,26.84 39.71,22.84 45.21,17.34 XT60.V+ | 39.71,55.34 39.71,65.84 | 39.71,65.84 39.71,77.34 D2.2 | v35.71,86.84 v35.71,125.84 35.71,128.84 D4.2 | v29.21,85.84 29.21,75.34 38.71,65.84 39.71,65.84 | v105.21,125.34 105.21,104.34 107.21,102.34 R7.2 | v40.71,55.34 39.71,55.34
  Bottom 2.032: v121.21,57.84 120.21,56.84 v99.21,56.84 98.21,56.84 96.71,55.34 v40.71,55.34 | v35.71,86.84 34.71,85.84 v29.21,85.84 | v105.21,125.34 104.71,125.84 v35.71,125.84

### Text on the board
tPlace: SHORT | LONG | LONG | SHORT | RHOBAN SSL rev0
bPlace: RHOBAN SSL MAINBOARD | REV0
tNames: BOOST_EN